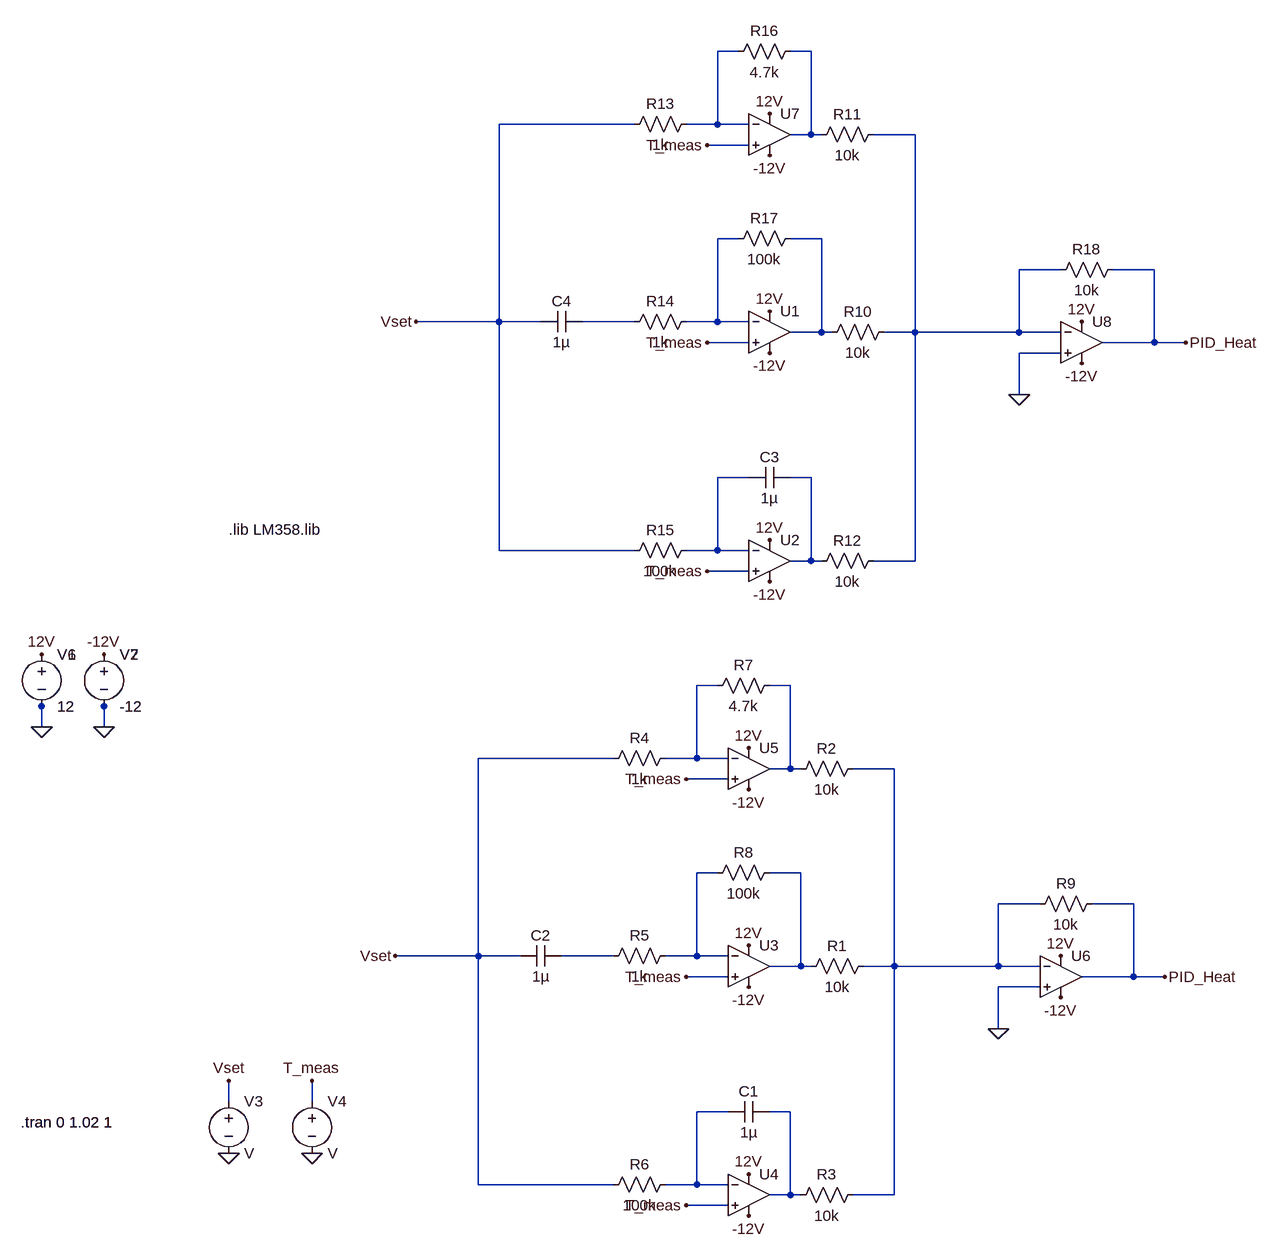
[diagram p0: schematic part-2v10.asc]
part-2v10.asc, the LTspice schematic file:
Version 4
SHEET 1 3304 1124
WIRE 2336 -3408 2304 -3408
WIRE 2448 -3408 2416 -3408
WIRE 2176 -3296 1968 -3296
WIRE 2304 -3296 2304 -3408
WIRE 2304 -3296 2256 -3296
WIRE 2352 -3296 2304 -3296
WIRE 2448 -3280 2448 -3408
WIRE 2448 -3280 2416 -3280
WIRE 2464 -3280 2448 -3280
WIRE 2608 -3280 2544 -3280
WIRE 2352 -3264 2288 -3264
WIRE 2336 -3120 2304 -3120
WIRE 2464 -3120 2416 -3120
WIRE 2832 -3072 2768 -3072
WIRE 2976 -3072 2912 -3072
WIRE 1968 -2992 1968 -3296
WIRE 1968 -2992 1840 -2992
WIRE 2032 -2992 1968 -2992
WIRE 2176 -2992 2096 -2992
WIRE 2304 -2992 2304 -3120
WIRE 2304 -2992 2256 -2992
WIRE 2352 -2992 2304 -2992
WIRE 2464 -2976 2464 -3120
WIRE 2464 -2976 2416 -2976
WIRE 2480 -2976 2464 -2976
WIRE 2608 -2976 2608 -3280
WIRE 2608 -2976 2560 -2976
WIRE 2768 -2976 2768 -3072
WIRE 2768 -2976 2608 -2976
WIRE 2832 -2976 2768 -2976
WIRE 2352 -2960 2288 -2960
WIRE 2976 -2960 2976 -3072
WIRE 2976 -2960 2896 -2960
WIRE 3024 -2960 2976 -2960
WIRE 2832 -2944 2768 -2944
WIRE 2768 -2880 2768 -2944
WIRE 2352 -2752 2304 -2752
WIRE 2448 -2752 2416 -2752
WIRE 1968 -2640 1968 -2992
WIRE 2176 -2640 1968 -2640
WIRE 2304 -2640 2304 -2752
WIRE 2304 -2640 2256 -2640
WIRE 2352 -2640 2304 -2640
WIRE 2448 -2624 2448 -2752
WIRE 2448 -2624 2416 -2624
WIRE 2464 -2624 2448 -2624
WIRE 2608 -2624 2608 -2976
WIRE 2608 -2624 2544 -2624
WIRE 2352 -2608 2288 -2608
WIRE 2304 -2432 2272 -2432
WIRE 2416 -2432 2384 -2432
WIRE 1264 -2368 1264 -2400
WIRE 1360 -2368 1360 -2400
WIRE 2144 -2320 1936 -2320
WIRE 2272 -2320 2272 -2432
WIRE 2272 -2320 2224 -2320
WIRE 2320 -2320 2272 -2320
WIRE 2416 -2304 2416 -2432
WIRE 2416 -2304 2384 -2304
WIRE 2432 -2304 2416 -2304
WIRE 2576 -2304 2512 -2304
WIRE 2320 -2288 2256 -2288
WIRE 2304 -2144 2272 -2144
WIRE 2432 -2144 2384 -2144
WIRE 2800 -2096 2736 -2096
WIRE 2944 -2096 2880 -2096
WIRE 1936 -2016 1936 -2320
WIRE 1936 -2016 1808 -2016
WIRE 2000 -2016 1936 -2016
WIRE 2144 -2016 2064 -2016
WIRE 2272 -2016 2272 -2144
WIRE 2272 -2016 2224 -2016
WIRE 2320 -2016 2272 -2016
WIRE 2432 -2000 2432 -2144
WIRE 2432 -2000 2384 -2000
WIRE 2448 -2000 2432 -2000
WIRE 2576 -2000 2576 -2304
WIRE 2576 -2000 2528 -2000
WIRE 2736 -2000 2736 -2096
WIRE 2736 -2000 2576 -2000
WIRE 2800 -2000 2736 -2000
WIRE 2320 -1984 2256 -1984
WIRE 2944 -1984 2944 -2096
WIRE 2944 -1984 2864 -1984
WIRE 2992 -1984 2944 -1984
WIRE 2800 -1968 2736 -1968
WIRE 2736 -1904 2736 -1968
WIRE 1552 -1792 1552 -1824
WIRE 1680 -1792 1680 -1824
WIRE 2320 -1776 2272 -1776
WIRE 2416 -1776 2384 -1776
WIRE 1936 -1664 1936 -2016
WIRE 2144 -1664 1936 -1664
WIRE 2272 -1664 2272 -1776
WIRE 2272 -1664 2224 -1664
WIRE 2320 -1664 2272 -1664
WIRE 2416 -1648 2416 -1776
WIRE 2416 -1648 2384 -1648
WIRE 2432 -1648 2416 -1648
WIRE 2576 -1648 2576 -2000
WIRE 2576 -1648 2512 -1648
WIRE 2320 -1632 2256 -1632
FLAG 1264 -2368 0
FLAG 1264 -2480 12V
FLAG 1360 -2368 0
FLAG 1360 -2480 -12V
FLAG 2352 -1968 -12V
FLAG 2352 -2032 12V
FLAG 2352 -1616 -12V
FLAG 2352 -1680 12V
FLAG 2352 -2272 -12V
FLAG 2352 -2336 12V
FLAG 2832 -1952 -12V
FLAG 2832 -2016 12V
FLAG 1552 -1824 Vset
FLAG 1808 -2016 Vset
FLAG 1680 -1824 T_meas
FLAG 2256 -2288 T_meas
FLAG 2736 -1904 0
FLAG 2256 -1632 T_meas
FLAG 2256 -1984 T_meas
FLAG 1552 -1712 0
FLAG 1680 -1712 0
FLAG 2992 -1984 PID_Heat
FLAG 2384 -2944 -12V
FLAG 2384 -3008 12V
FLAG 2384 -2592 -12V
FLAG 2384 -2656 12V
FLAG 2384 -3248 -12V
FLAG 2384 -3312 12V
FLAG 2864 -2928 -12V
FLAG 2864 -2992 12V
FLAG 1840 -2992 Vset
FLAG 2288 -3264 T_meas
FLAG 2768 -2880 0
FLAG 2288 -2608 T_meas
FLAG 2288 -2960 T_meas
FLAG 3024 -2960 PID_Heat
SYMBOL voltage 1264 -2496 R0
SYMATTR InstName V1
SYMATTR Value 12
SYMBOL voltage 1360 -2496 R0
WINDOW 123 0 0 Left 0
WINDOW 39 0 0 Left 0
SYMATTR InstName V2
SYMATTR Value -12
SYMBOL voltage 1264 -2496 R0
SYMATTR InstName V6
SYMATTR Value 12
SYMBOL voltage 1360 -2496 R0
WINDOW 123 0 0 Left 0
WINDOW 39 0 0 Left 0
SYMATTR InstName V7
SYMATTR Value -12
SYMBOL Opamps\\UniversalOpamp2 2352 -2000 R0
SYMATTR InstName U3
SYMBOL Opamps\\UniversalOpamp2 2352 -1648 R0
SYMATTR InstName U4
SYMBOL Opamps\\UniversalOpamp2 2352 -2304 R0
SYMATTR InstName U5
SYMBOL Opamps\\UniversalOpamp2 2832 -1984 R0
SYMATTR InstName U6
SYMBOL res 2544 -2016 R90
WINDOW 0 0 56 VBottom 2
WINDOW 3 32 56 VTop 2
SYMATTR InstName R1
SYMATTR Value 10k
SYMBOL res 2528 -2320 R90
WINDOW 0 0 56 VBottom 2
WINDOW 3 32 56 VTop 2
SYMATTR InstName R2
SYMATTR Value 10k
SYMBOL res 2528 -1664 R90
WINDOW 0 0 56 VBottom 2
WINDOW 3 32 56 VTop 2
SYMATTR InstName R3
SYMATTR Value 10k
SYMBOL res 2240 -2336 R90
WINDOW 0 0 56 VBottom 2
WINDOW 3 32 56 VTop 2
SYMATTR InstName R4
SYMATTR Value 1k
SYMBOL res 2240 -2032 R90
WINDOW 0 0 56 VBottom 2
WINDOW 3 32 56 VTop 2
SYMATTR InstName R5
SYMATTR Value 1k
SYMBOL res 2240 -1680 R90
WINDOW 0 0 56 VBottom 2
WINDOW 3 32 56 VTop 2
SYMATTR InstName R6
SYMATTR Value 100k
SYMBOL res 2400 -2448 R90
WINDOW 0 0 56 VBottom 2
WINDOW 3 32 56 VTop 2
SYMATTR InstName R7
SYMATTR Value 4.7k
SYMBOL res 2400 -2160 R90
WINDOW 0 0 56 VBottom 2
WINDOW 3 32 56 VTop 2
SYMATTR InstName R8
SYMATTR Value 100k
SYMBOL cap 2384 -1792 R90
WINDOW 0 0 32 VBottom 2
WINDOW 3 32 32 VTop 2
SYMATTR InstName C1
SYMATTR Value 1µ
SYMBOL cap 2064 -2032 R90
WINDOW 0 0 32 VBottom 2
WINDOW 3 32 32 VTop 2
SYMATTR InstName C2
SYMATTR Value 1µ
SYMBOL voltage 1552 -1808 R0
SYMATTR InstName V3
SYMBOL voltage 1680 -1808 R0
SYMATTR InstName V4
SYMBOL res 2896 -2112 R90
WINDOW 0 0 56 VBottom 2
WINDOW 3 32 56 VTop 2
SYMATTR InstName R9
SYMATTR Value 10k
SYMBOL Opamps\\UniversalOpamp2 2384 -2976 R0
SYMATTR InstName U1
SYMBOL Opamps\\UniversalOpamp2 2384 -2624 R0
SYMATTR InstName U2
SYMBOL Opamps\\UniversalOpamp2 2384 -3280 R0
SYMATTR InstName U7
SYMBOL Opamps\\UniversalOpamp2 2864 -2960 R0
SYMATTR InstName U8
SYMBOL res 2576 -2992 R90
WINDOW 0 0 56 VBottom 2
WINDOW 3 32 56 VTop 2
SYMATTR InstName R10
SYMATTR Value 10k
SYMBOL res 2560 -3296 R90
WINDOW 0 0 56 VBottom 2
WINDOW 3 32 56 VTop 2
SYMATTR InstName R11
SYMATTR Value 10k
SYMBOL res 2560 -2640 R90
WINDOW 0 0 56 VBottom 2
WINDOW 3 32 56 VTop 2
SYMATTR InstName R12
SYMATTR Value 10k
SYMBOL res 2272 -3312 R90
WINDOW 0 0 56 VBottom 2
WINDOW 3 32 56 VTop 2
SYMATTR InstName R13
SYMATTR Value 1k
SYMBOL res 2272 -3008 R90
WINDOW 0 0 56 VBottom 2
WINDOW 3 32 56 VTop 2
SYMATTR InstName R14
SYMATTR Value 1k
SYMBOL res 2272 -2656 R90
WINDOW 0 0 56 VBottom 2
WINDOW 3 32 56 VTop 2
SYMATTR InstName R15
SYMATTR Value 100k
SYMBOL res 2432 -3424 R90
WINDOW 0 0 56 VBottom 2
WINDOW 3 32 56 VTop 2
SYMATTR InstName R16
SYMATTR Value 4.7k
SYMBOL res 2432 -3136 R90
WINDOW 0 0 56 VBottom 2
WINDOW 3 32 56 VTop 2
SYMATTR InstName R17
SYMATTR Value 100k
SYMBOL cap 2416 -2768 R90
WINDOW 0 0 32 VBottom 2
WINDOW 3 32 32 VTop 2
SYMATTR InstName C3
SYMATTR Value 1µ
SYMBOL cap 2096 -3008 R90
WINDOW 0 0 32 VBottom 2
WINDOW 3 32 32 VTop 2
SYMATTR InstName C4
SYMATTR Value 1µ
SYMBOL res 2928 -3088 R90
WINDOW 0 0 56 VBottom 2
WINDOW 3 32 56 VTop 2
SYMATTR InstName R18
SYMATTR Value 10k
TEXT 1552 -2672 Left 2 !.lib LM358.lib
TEXT 1232 -1760 Left 2 !.tran 0 1.02 1
TEXT 1232 -1760 Left 2 !.tran 0 1.02 1

The netlist it stands for:
* part-2v10.asc
V1 12V 0 12
V2 -12V 0 -12
V6 12V 0 12
V7 -12V 0 -12
XU3 T_meas N012 12V -12V N013 level.2 Avol=1Meg GBW=10Meg Slew=10Meg ilimit=25m rail=0 Vos=0 phimargin=45 en=0 enk=0 in=0 ink=0 Rin=500Meg  ; pins IN+ IN- V+ V- OUT
XU4 T_meas N015 12V -12V N016 level.2 Avol=1Meg GBW=10Meg Slew=10Meg ilimit=25m rail=0 Vos=0 phimargin=45 en=0 enk=0 in=0 ink=0 Rin=500Meg  ; pins IN+ IN- V+ V- OUT
XU5 T_meas N009 12V -12V N010 level.2 Avol=1Meg GBW=10Meg Slew=10Meg ilimit=25m rail=0 Vos=0 phimargin=45 en=0 enk=0 in=0 ink=0 Rin=500Meg  ; pins IN+ IN- V+ V- OUT
XU6 0 N011 12V -12V PID_Heat level.2 Avol=1Meg GBW=10Meg Slew=10Meg ilimit=25m rail=0 Vos=0 phimargin=45 en=0 enk=0 in=0 ink=0 Rin=500Meg  ; pins IN+ IN- V+ V- OUT
R1 N011 N013 10k
R2 N011 N010 10k
R3 N011 N016 10k
R4 N009 Vset 1k
R5 N012 N014 1k
R6 N015 Vset 100k
R7 N010 N009 4.7k
R8 N013 N012 100k
C1 N016 N015 1µ
C2 N014 Vset 1µ
V3 Vset 0 V
V4 T_meas 0 V
R9 PID_Heat N011 10k
XU1 T_meas N004 12V -12V N005 level.2 Avol=1Meg GBW=10Meg Slew=10Meg ilimit=25m rail=0 Vos=0 phimargin=45 en=0 enk=0 in=0 ink=0 Rin=500Meg  ; pins IN+ IN- V+ V- OUT
XU2 T_meas N007 12V -12V N008 level.2 Avol=1Meg GBW=10Meg Slew=10Meg ilimit=25m rail=0 Vos=0 phimargin=45 en=0 enk=0 in=0 ink=0 Rin=500Meg  ; pins IN+ IN- V+ V- OUT
XU7 T_meas N001 12V -12V N002 level.2 Avol=1Meg GBW=10Meg Slew=10Meg ilimit=25m rail=0 Vos=0 phimargin=45 en=0 enk=0 in=0 ink=0 Rin=500Meg  ; pins IN+ IN- V+ V- OUT
XU8 0 N003 12V -12V PID_Heat level.2 Avol=1Meg GBW=10Meg Slew=10Meg ilimit=25m rail=0 Vos=0 phimargin=45 en=0 enk=0 in=0 ink=0 Rin=500Meg  ; pins IN+ IN- V+ V- OUT
R10 N003 N005 10k
R11 N003 N002 10k
R12 N003 N008 10k
R13 N001 Vset 1k
R14 N004 N006 1k
R15 N007 Vset 100k
R16 N002 N001 4.7k
R17 N005 N004 100k
C3 N008 N007 1µ
C4 N006 Vset 1µ
R18 PID_Heat N003 10k
.lib LM358.lib
.tran 0 1.02 1
.tran 0 1.02 1
.lib UniversalOpamps2.sub
.backanno
.end